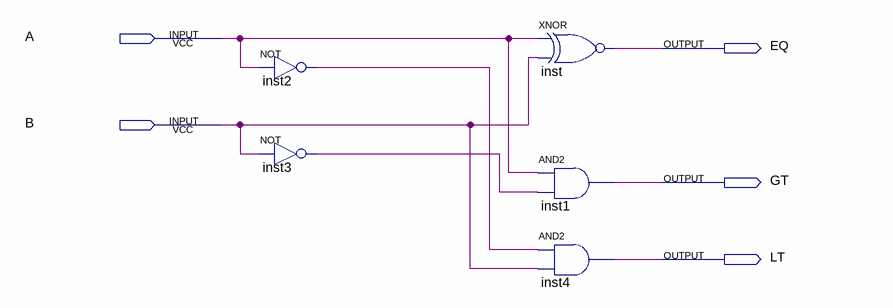
[diagram p0: schematic sheet]
// Quartus schematic 1bit_comparator.bdf as structural Verilog: 5 symbols, 5 pins
module \1bit_comparator  (
  input  A,
  input  B,
  output EQ,
  output GT,
  output LT
);

  wire inst2_out, inst3_out;

  not inst2 (inst2_out, A);
  not inst3 (inst3_out, B);
  xnor inst (EQ, A, B);
  and inst1 (GT, A, inst3_out);
  and inst4 (LT, inst2_out, B);
endmodule
